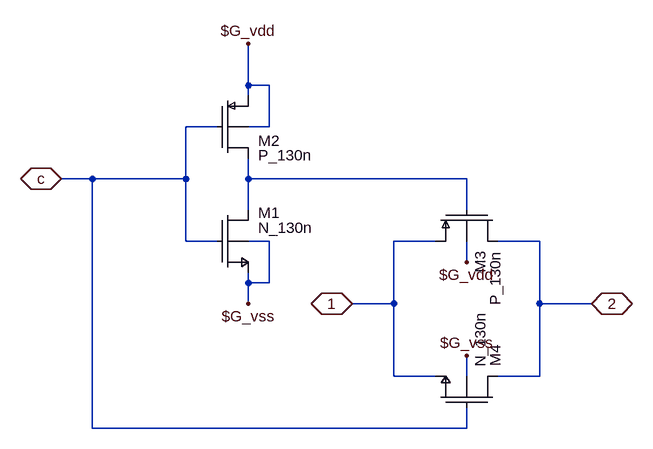
[diagram p0: schematic com_tgate.asc]
com_tgate.asc, the LTspice schematic file:
Version 4
SHEET 1 1084 680
WIRE 480 16 480 -48
WIRE 512 16 480 16
WIRE 480 32 480 16
WIRE 432 80 384 80
WIRE 512 80 512 16
WIRE 512 80 480 80
WIRE 240 160 192 160
WIRE 384 160 384 80
WIRE 384 160 240 160
WIRE 480 160 480 128
WIRE 816 160 480 160
WIRE 480 208 480 160
WIRE 816 208 816 160
WIRE 384 256 384 160
WIRE 432 256 384 256
WIRE 512 256 480 256
WIRE 768 256 704 256
WIRE 928 256 864 256
WIRE 816 288 816 256
WIRE 480 320 480 304
WIRE 512 320 512 256
WIRE 512 320 480 320
WIRE 480 352 480 320
WIRE 704 352 704 256
WIRE 704 352 640 352
WIRE 928 352 928 256
WIRE 1008 352 928 352
WIRE 704 464 704 352
WIRE 768 464 704 464
WIRE 816 464 816 432
WIRE 928 464 928 352
WIRE 928 464 864 464
WIRE 240 544 240 160
WIRE 816 544 816 512
WIRE 816 544 240 544
FLAG 480 -48 $G_vdd
FLAG 640 352 1
IOPIN 640 352 BiDir
FLAG 192 160 c
IOPIN 192 160 BiDir
FLAG 1008 352 2
IOPIN 1008 352 BiDir
FLAG 480 352 $G_vss
FLAG 816 288 $G_vdd
FLAG 816 432 $G_vss
SYMBOL nmosb 432 208 R0
SYMATTR InstName M1
SYMATTR Value N_130n
SYMATTR Value2 l=0.2u w=0.2u ad=40f as=40f pd=0.8u ps=0.8u m=1
SYMBOL pmosb 432 32 R0
SYMATTR InstName M2
SYMATTR Value P_130n
SYMATTR Value2 l=0.2u w=0.2u ad=40f as=40f pd=0.8u ps=0.8u m=3
SYMBOL pmosb 768 208 M90
SYMATTR InstName M3
SYMATTR Value P_130n
SYMATTR Value2 l=0.2u w=0.2u ad=40f as=40f pd=0.8u ps=0.8u m=3
SYMBOL nmosb 864 512 M270
SYMATTR InstName M4
SYMATTR Value N_130n
SYMATTR Value2 l=0.2u w=0.2u ad=40f as=40f pd=0.8u ps=0.8u m=1

The netlist it stands for:
* com_tgate.asc
M1 N001 c $G_vss $G_vss N_130n l=0.2u w=0.2u ad=40f as=40f pd=0.8u ps=0.8u m=1
M2 N001 c $G_vdd $G_vdd P_130n l=0.2u w=0.2u ad=40f as=40f pd=0.8u ps=0.8u m=3
M3 2 N001 1 $G_vdd P_130n l=0.2u w=0.2u ad=40f as=40f pd=0.8u ps=0.8u m=3
M4 2 c 1 $G_vss N_130n l=0.2u w=0.2u ad=40f as=40f pd=0.8u ps=0.8u m=1
.model NMOS NMOS
.model PMOS PMOS
.lib standard.mos
.backanno
.end